# EAGLE design daclock-3.1 (EAGLE 9.4.2)
PROJECT_AUTHOR: tinkerman.cat <xose.perez@gmail.com>; PROJECT_LICENSE: CC-BY-SA-NC 3.0; PROJECT_NAME: DACLOCK WIFI; PROJECT_VERSION: 3.1.20200124
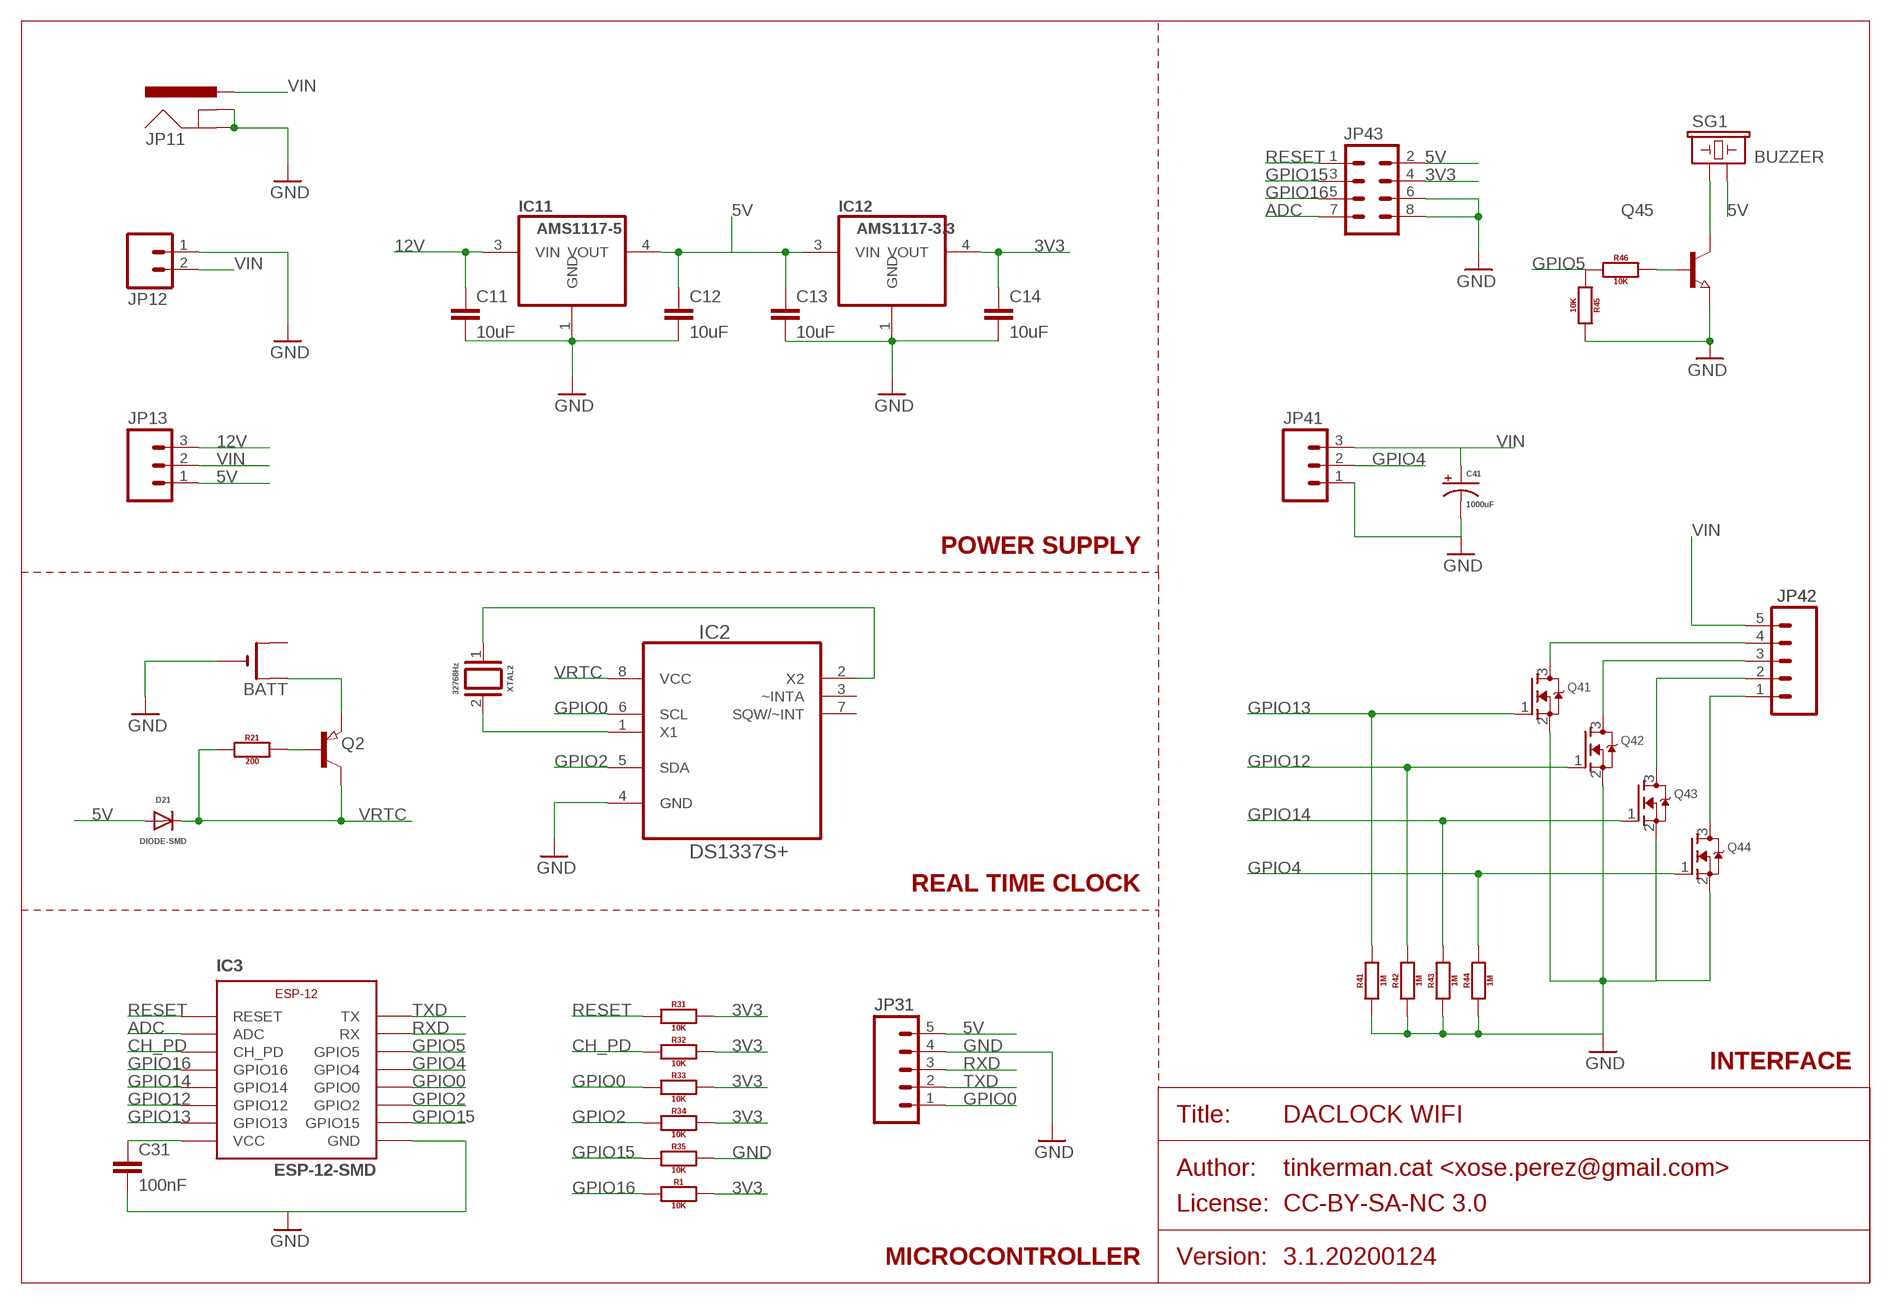
[diagram p0: schematic, sheet 1]

## Parts
BATT  CR2032SMT  [CR2032-SMD]
C11  10uF  C-EU0805  [0805]
C12  10uF  C-EU0805  [0805]
C13  10uF  C-EU0805  [0805]
C14  10uF  C-EU0805  [0805]
C31  100nF  C-EU0805  [0805]
C41  1000uF  CAP_POLG  [PANASONIC_G]
D21  DIODE-SMD  [0805_DIODE]
IC2  DS1337S+  [SOIC127P600X175-8N]
IC3  ESP-12-SMD  [ESP-12-SMD]
IC11  AMS1117-5  REG1117SOT223-2  [SOT223]
IC12  AMS1117-3.3  REG1117SOT223-2  [SOT223]
JP11  POWER_JACKPTH  [POWER_JACK_PTH]
JP12  M02200MIL  [SCREWTERMINAL-200MIL-2]
JP13  M03PTH  [1X03]
JP31  M05NO_SILK  [1X05_NO_SILK]
JP41  M03200MIL  [SCREWTERMINAL-200MIL-3]
JP42  M05NO_SILK  [1X05_NO_SILK]
JP43  M04X2  [2X4]
Q2  PNP-TRANSISTOR_SOT23  [SOT23]
Q41  MOSFET-NREFLOW  [SOT23]
Q42  MOSFET-NREFLOW  [SOT23]
Q43  MOSFET-NREFLOW  [SOT23]
Q44  MOSFET-NREFLOW  [SOT23]
Q45  NPN-TRANSISTOR_SOT23  [SOT23]
R1  10K  RESISTOR0805  [0805]
R21  200  RESISTOR0805  [0805]
R31  10K  RESISTOR0805  [0805]
R32  10K  RESISTOR0805  [0805]
R33  10K  RESISTOR0805  [0805]
R34  10K  RESISTOR0805  [0805]
R35  10K  RESISTOR0805  [0805]
R41  1M  RESISTOR0805  [0805]
R42  1M  RESISTOR0805  [0805]
R43  1M  RESISTOR0805  [0805]
R44  1M  RESISTOR0805  [0805]
R45  10K  RESISTOR0805  [0805]
R46  10K  RESISTOR0805  [0805]
SG1  BUZZER  BUZZERPTH  [BUZZER-12MM]
XTAL2  32768Hz  CRYSTAL_TC38H  [TC38H]

## Nets
3V3: C14.1 C31.1 IC3.VCC IC12.4(VOUT) JP43.4 R1.2 R31.2 R32.2 R33.2 R34.2
5V: C12.1 C13.1 D21.A IC11.4(VOUT) IC12.3(VIN) JP13.1 JP31.5 JP43.2 SG1.-
12V: C11.1 IC11.3(VIN) JP13.3
ADC: IC3.ADC JP43.7
CH_PD: IC3.CH_PD R32.1
GND: BATT.- C11.2 C12.2 C13.2 C14.2 C31.2 C41.- IC2.4(GND) IC3.GND IC11.1(GND) IC12.1(GND) JP11.GND JP11.GNDBREAK JP12.1 JP31.4 JP41.1 JP43.6 JP43.8 Q41.2(S) Q42.2(S) Q43.2(S) Q44.2(S) Q45.2(E) R35.2 R41.1 R42.1 R43.1 R44.1 R45.2
GPIO0: IC2.6(SCL) IC3.GPIO0 JP31.1 R33.1
GPIO2: IC2.5(SDA) IC3.GPIO2 R34.1
GPIO4: IC3.GPIO4 JP41.2 Q44.1(G) R44.2
GPIO5: IC3.GPIO5 R45.1 R46.1
GPIO12: IC3.GPIO12 Q42.1(G) R42.2
GPIO13: IC3.GPIO13 Q41.1(G) R41.2
GPIO14: IC3.GPIO14 Q43.1(G) R43.2
GPIO15: IC3.GPIO15 JP43.3 R35.1
GPIO16: IC3.GPIO16 JP43.5 R1.1
N$1: Q45.1(B) R46.2
N$2: IC2.1(X1) XTAL2.2
N$3: IC2.2(X2) XTAL2.1
N$4: JP42.4 Q41.3(D)
N$5: Q2.1(B) R21.2
N$6: JP42.3 Q42.3(D)
N$7: BATT.+$1(+) Q2.2(E)
N$8: JP42.2 Q43.3(D)
N$9: JP42.1 Q44.3(D)
N$10: Q45.3(C) SG1.+
RESET: IC3.RESET JP43.1 R31.1
RXD: IC3.RX JP31.3
TXD: IC3.TX JP31.2
VIN: C41.+ JP11.PWR JP12.2 JP13.2 JP41.3 JP42.5
VRTC: D21.C IC2.8(VCC) Q2.3(C) R21.1
Unconnected: BATT.+$2(+1) IC2.3(~INTA) IC2.7(SQW/~INT)

## Notes on the sheet
- POWER SUPPLY
- REAL TIME CLOCK
- INTERFACE
- MICROCONTROLLER

## Library data of the parts
BATT = xose:CR2032
C11-C14 C31 = xose:C-EU: CAPACITOR, European symbol
C41 = xose:CAP_POL: Capacitor Polarized These are standard SMD and PTH capacitors. Normally 10uF, 47uF, and 100uF in electrolytic and tantalum varieties. Always verify the external diameter of the through hole cap, it varies with capacity, voltage, and manufacturer. The EIA devices should be standard.
D21 = xose:DIODE
IC2 = xose:DS1337S+: 64 x 8, Serial, I2C Real-Time Clock; MPN: DS1337S+; OC_FARNELL: 1379748; OC_NEWARK: 08J6237; PACKAGE: SOIC-8; SUPPLIER: Maxim
IC3 = xose:ESP-12
IC11 IC12 = xose:REG1117: 800mA and 1A Low Dropout (LDO) Positive Regulator 1.8V, 2.5V, 2.85V, 3.3V, 5V, and Adj
JP11 = xose:POWER_JACK: Power Jack This is the standard 5.5mm barrel jack for power. The PTH is the most common, proven, reliable, footprint. The Slot footprint only works if the mill layer is transmitted to the PCB fab house so be warned. Mating wall wart : TOL-00298 (and others); PROD_ID: CONN-08197
JP12 = xose:M02: Standard 2-pin 0.1" header. Use with - straight break away headers ( PRT-00116) - right angle break away headers (PRT-00553) - swiss pins (PRT-00743) - machine pins (PRT-00117) - female headers (PRT-00115) Molex polarized connector foot print use with: PRT-08233 with associated crimp pins and housings. 2.54_SCREWTERM for use with PRT-10571. 3.5mm Screw Terminal footprints for PRT-08084 5mm Screw Terminal footprints for use with PRT-08432
JP13 JP41 = xose:M03: Header 3 Standard 3-pin 0.1" header. Use with straight break away headers (SKU : PRT-00116), right angle break away headers (PRT-00553), swiss pins (PRT-00743), machine pins (PRT-00117), and female headers (PRT-00115). Molex polarized connector foot print use with SKU : PRT-08232 with associated crimp pins and housings.
JP31 JP42 = xose:M05: Header 5 Standard 5-pin 0.1" header. Use with straight break away headers (SKU : PRT-00116), right angle break away headers (PRT-00553), swiss pins (PRT-00743), machine pins (PRT-00117), and female headers (PRT-00115). Molex polarized connector foot print use with SKU : PRT-08230 with associated crimp pins and housings.
JP43 = xose:M04X2: .1" header, two rows of four.
Q2 = semicon-smd-ipc:PNP-TRANSISTOR_: PNP TRANSISTOR
Q41-Q44 = adafruit:MOSFET-N: N-Channel Mosfet 2N7002E - 60V 260mA SOT23 [Digikey: 2N7002ET1GOSTR-ND] - REEL BSH103 - 30V 850mA SOT23 [Digikey: 568-5013-1-ND]
Q45 = semicon-smd-ipc:NPN-TRANSISTOR_: NPN TRANSISTOR
R1 R21 R31-R35 R41-R46 = xose:RESISTOR: Generic EU resistor symbol
SG1 = SparkFun-Electromechanical:BUZZER: Buzzer 12mm Spark Fun Electronics SKU : Comp-Buzzer
XTAL2 = xose:CRYSTAL_TC38H

## Board
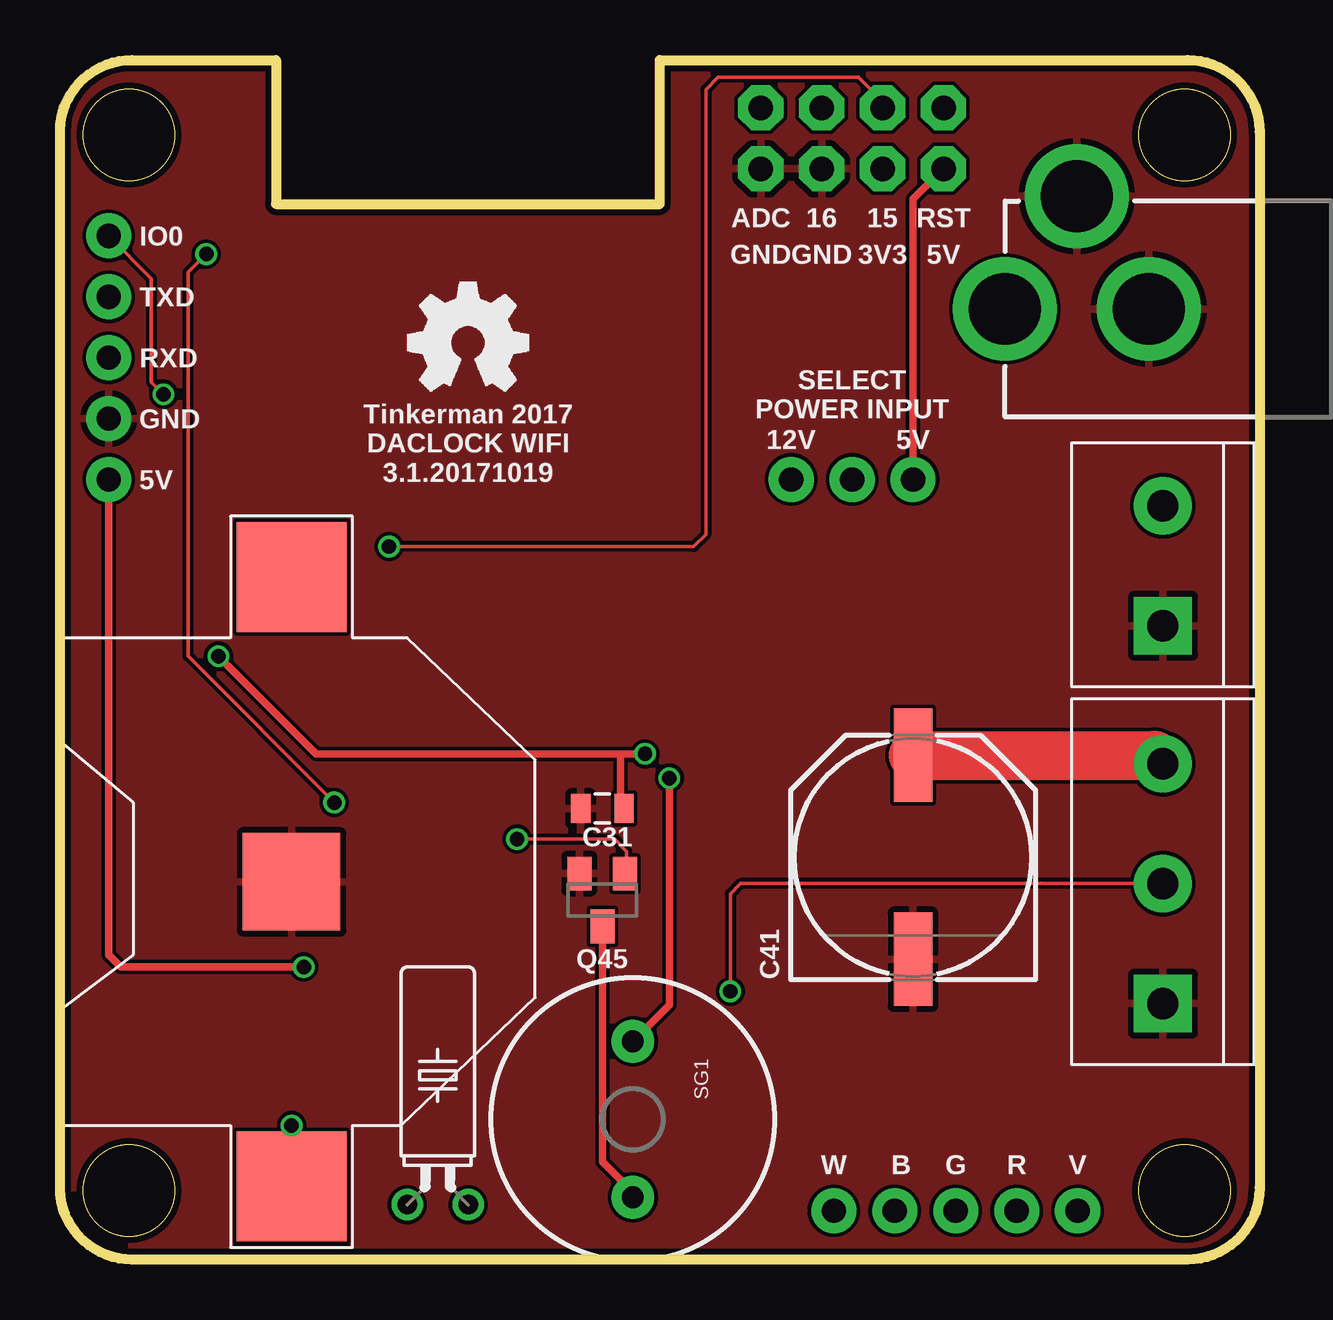
[diagram p1: board, top side]
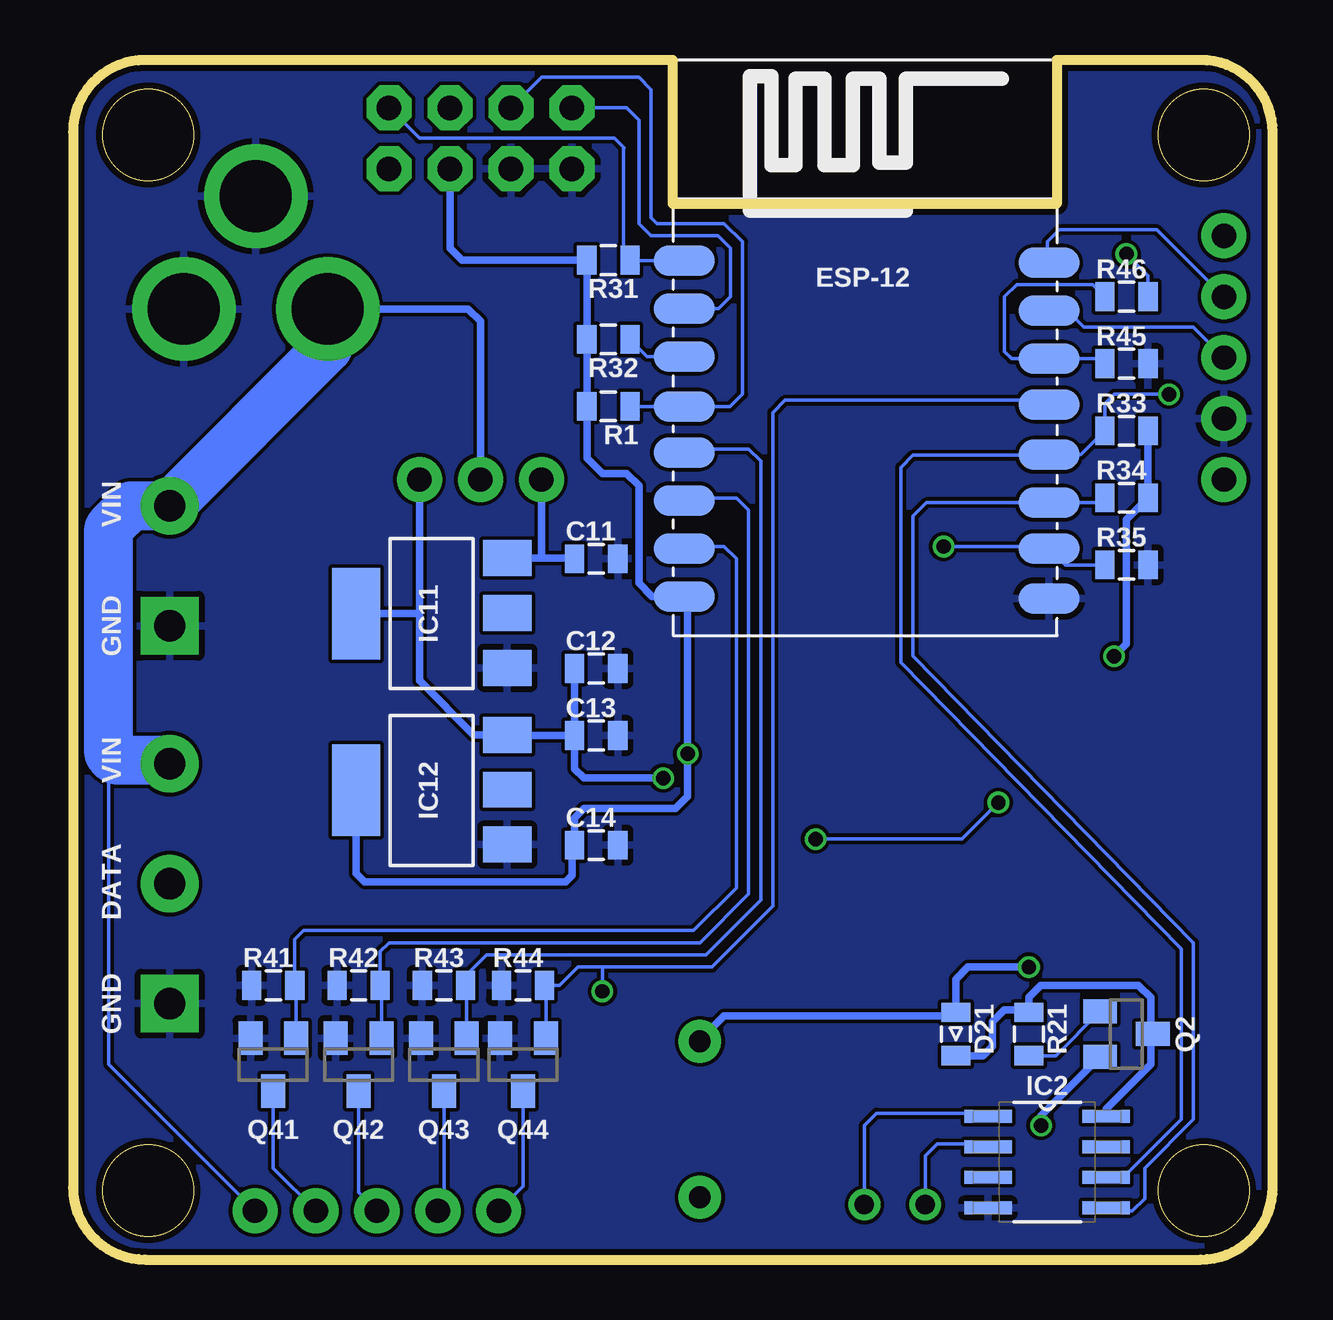
[diagram p2: board, bottom side, seen from below]

Size 50 x 50 mm. Coordinates in mm from the lower left corner, seen from the top.
Outline: 0,3 0,47 arc-90 3,50 9,50 9,44 25,44 25,50 47,50 arc-90 50,47 50,3 arc-90 47,0 3,0 arc-90 0,3
Outline: circle at 2.87,46.87 radius 1.91
Outline: circle at 46.87,46.87 radius 1.91
Outline: circle at 2.87,2.87 radius 1.91
Outline: circle at 46.87,2.87 radius 1.91
Copper layers (1*16): Top 0.035mm / dielectric 1.5mm / Bottom 0.035mm
Design rules "seedstudio-2layer": minimum track width 6mil, minimum drill 12mil, track to track 6mil, track to pad 6mil, pad to pad 6mil, via to via 6mil, smd to smd 0mil, copper to edge 10mil, drill to drill 10mil, minimum pad ring 10mil, minimum via ring 6mil, stop-mask expansion 2mil, vias tented up to drill 100mil, thermal gap 10mil

### Footprints (pad centres in the part's own frame; a part is rotated, then mirrored left to right if it is on the bottom)
CR2032-SMD = smd 4.572 x 4.572: +$1 -12.7,0; +$2 12.7,0 | smd 4.064 x 4.064: - 0,0
0805 = smd 0.8 x 1.2: 1 -0.9,0; 2 0.9,0
PANASONIC_G = smd 3.9 x 1.6: + 4.25,0; - -4.25,0
0805_DIODE = smd 0.8 x 1.2: A -0.9,0; C 0.9,0
SOIC127P600X175-8N = smd 1.981 x 0.533: 1 -2.464,1.905; 2 -2.464,0.635; 3 -2.464,-0.635; 4 -2.464,-1.905; 5 2.464,-1.905; 6 2.464,-0.635; 7 2.464,0.635; 8 2.464,1.905
ESP-12-SMD = smd 2.54 x 1.27: ADC -7,5.1; CH_PD -7,3.1; GND 8.2,-7; GPIO0 8.2,-1; GPIO2 8.2,-3; GPIO4 8.2,1.1; GPIO5 8.2,3; GPIO12 -7,-2.9; GPIO13 -7,-4.9; GPIO14 -7,-0.9; GPIO15 8.2,-4.9; GPIO16 -7,1; RESET -7,7.1; RX 8.2,5; TX 8.2,7; VCC -7,-6.9
SOT223 = smd 1.499 x 2.007: 1 -2.261,-3.15; 2 0.025,-3.15; 3 2.311,-3.15 | smd 3.81 x 2.007: 4 0,3.15
POWER_JACK_PTH = drill 2.997 pad 4.318: GND 0,7.7; GNDBREAK 4.7,10.7; PWR 0,13.7
SCREWTERMINAL-200MIL-2 = drill 1.3 pad 2.413 square: 1 0,0 | drill 1.3 pad 2.413: 2 5,0
1X03 = drill 1.016 pad 1.88: 1 0,0; 2 2.54,0; 3 5.08,0
1X05_NO_SILK = drill 1.016 pad 1.88: 1 0,0; 2 2.54,0; 3 5.08,0; 4 7.62,0; 5 10.16,0
SCREWTERMINAL-200MIL-3 = drill 1.3 pad 2.413 square: 1 0,0 | drill 1.3 pad 2.413: 2 5,0; 3 10,0
2X4 = drill 1.016 pad 1.88 octagon: 1 -3.81,-1.27; 2 -3.81,1.27; 3 -1.27,-1.27; 4 -1.27,1.27; 5 1.27,-1.27; 6 1.27,1.27; 7 3.81,-1.27; 8 3.81,1.27
SOT23 = smd 1 x 1.4: 1 -0.95,-1.1; 2 0.95,-1.1; 3 0,1.1
BUZZER-12MM = drill 0.9 pad 1.778: + 3.25,0; - -3.25,0
TC38H = drill 0.813: 1 -1.27,0; 2 1.27,0

### Placement (x,y rotation side)
BATT  9.65,15.75 90 top
C11  28.19,29.21 0 bottom
C12  28.19,24.64 0 bottom
C13  28.19,21.84 0 bottom
C14  28.19,17.27 0 bottom
C31  22.61,18.8 180 top
C41  35.56,16.76 90 top
D21  13.21,9.4 270 bottom
IC2  9.4,4.06 0 bottom
IC3  17.53,34.54 0 bottom
IC11  35.05,26.92 90 bottom
IC12  35.05,19.56 90 bottom
JP11  53.09,39.62 90 top
JP12  45.97,26.42 90 top
JP13  35.56,32.51 180 top
JP31  2.03,42.67 270 top
JP41  45.97,10.67 90 top
JP42  32.26,2.03 0 top
JP43  33.02,46.74 180 top
Q2  6.1,9.4 270 bottom
Q41  41.66,8.13 180 bottom
Q42  38.1,8.13 180 bottom
Q43  34.54,8.13 180 bottom
Q44  31.24,8.13 180 bottom
Q45  22.61,14.99 180 top
R1  27.69,35.56 180 bottom
R21  10.16,9.4 270 bottom
R31  27.69,41.66 180 bottom
R32  27.69,38.35 180 bottom
R33  6.1,34.54 0 bottom
R34  6.1,31.75 0 bottom
R35  6.1,28.96 0 bottom
R41  41.66,11.43 0 bottom
R42  38.1,11.43 0 bottom
R43  34.54,11.43 0 bottom
R44  31.24,11.43 0 bottom
R45  6.1,37.34 0 bottom
R46  6.1,40.13 0 bottom
SG1  23.88,5.84 270 top
XTAL2  15.75,2.29 0 top

### Tracks (layer width: path | path; a pad name or v marks a point on that pad's centre or on a via)
3V3  (via drill 0.6)
  Top 0.305: v24.38,21.08 23.37,21.08 | 23.37,21.08 10.67,21.08 v6.6,25.15 | 23.37,21.08 23.37,18.93 C31.1
  Bottom 0.305: IC12.4 38.2,16.1 37.85,15.75 29.46,15.75 29.21,16 29.21,17.16 | C14.1 29.09,18.4 28.7,18.8 24.89,18.8 24.38,19.3 v24.38,21.08 24.38,27.25 IC3.VCC 25.87,27.64 26.42,28.19 26.42,32.26 26.92,32.77 27.94,32.77 28.59,33.41 R1.2 R32.2 | R32.2 R31.2 33.78,41.66 34.29,42.16 JP43.4 | 28.45,38.22 R32.2 | R33.2 R34.2 6.1,30.85 6.1,25.65 v6.6,25.15
  Bottom 0.508: 29.21,17.16 C14.1
5V  (via drill 0.6)
  Top 0.305: v25.4,20.07 25.4,10.62 SG1.- | v10.16,12.19 2.54,12.19 2.03,12.7 JP31.5 | JP13.1 35.56,44.2 JP43.2
  Bottom 0.305: v25.4,20.07 28.7,20.07 29.09,20.46 C13.1 | SG1.- 23.88,9.14 22.86,10.16 13.35,10.16 D21.A 13.21,11.68 12.7,12.19 v10.16,12.19 | C13.1 C12.1 | C13.1 31.88,21.84 | 35.56,26.92 35.56,24.13 33.3,21.87 IC12.3 | 35.56,26.92 JP13.1 | 35.56,26.92 IC11.4
  Bottom 0.508: 31.88,21.84 IC12.3
12V
  Bottom 0.305: IC11.3 30.48,29.23 | 30.48,29.23 29.12,29.23 C11.1 | 30.48,29.23 JP13.3
ADC
  Bottom 0.152: IC3.ADC 23.09,39.64 22.61,40.13 22.61,42.16 23.11,42.67 25.91,42.67 26.42,43.18 26.42,47.5 26.92,48.01 JP43.7
CH_PD
  Bottom 0.152: IC3.CH_PD 26.08,37.64 R32.1
GND
  pour Top: -0.51,50.55 50.8,50.55 50.8,-0.76 -0.51,-0.76
  pour Bottom: -1.02,51.31 51.31,51.31 51.31,-1.27 -1.02,-1.27
GPIO0  (via drill 0.6)
  Top 0.152: JP31.1 3.81,40.89 3.81,36.58 v4.32,36.07
  Bottom 0.152: IC2.6 6.22,3.43 3.81,5.84 3.81,12.95 15.49,24.89 15.49,33.02 14.99,33.53 9.34,33.53 IC3.GPIO0 8,33.54 R33.1 7,35.68 6.6,36.07 v4.32,36.07
GPIO2
  Bottom 0.152: 7.2,31.54 IC3.GPIO2 14.43,31.54 14.99,30.99 14.99,25.15 3.3,13.21 3.3,5.84 5.33,3.81 5.33,2.54 5.84,2.03 6.81,2.03 IC2.5
  Bottom 0.305: 7.2,31.54 R34.1
GPIO4  (via drill 0.6)
  Top 0.152: JP41.2 28.37,15.67 27.94,15.24 v27.94,11.18
  Bottom 0.152: Q44.1 30.29,11.38 | R44.2 29.72,11.43 28.96,12.19 27.94,12.19 | 27.94,12.19 23.37,12.19 20.83,14.73 20.83,35.31 20.32,35.81 9.5,35.81 IC3.GPIO4 | v27.94,11.18 27.94,12.19
  Bottom 0.305: 30.29,11.38 R44.2
GPIO5
  Bottom 0.152: 7.2,37.54 IC3.GPIO5 10.87,37.54 11.18,37.85 11.18,40.13 10.67,40.64 7.5,40.64 R46.1
  Bottom 0.305: 7.2,37.54 R45.1
GPIO12
  Bottom 0.152: Q42.1 37.15,11.38 R42.2 37.2,12.84 36.83,13.21 23.88,13.21 21.84,15.24 21.84,31.24 22.35,31.75 24.42,31.75 IC3.GPIO12
GPIO13
  Bottom 0.152: Q41.1 40.71,11.38 R41.2 40.76,13.35 40.39,13.72 24.13,13.72 22.35,15.49 22.35,29.21 22.86,29.72 24.45,29.72 IC3.GPIO13
GPIO14
  Bottom 0.152: Q43.1 33.59,11.38 R43.2 33.64,11.82 32.77,12.7 23.62,12.7 21.34,14.99 21.34,33.27 21.84,33.78 24.39,33.78 IC3.GPIO14
GPIO15  (via drill 0.6)
  Top 0.152: JP43.3 34.29,48.26 33.27,49.28 27.43,49.28 26.92,48.77 26.92,30.23 26.42,29.72 v13.72,29.72
  Bottom 0.152: R35.1 8.64,28.96 IC3.GPIO15 9.4,29.72 v13.72,29.72
GPIO16
  Bottom 0.152: JP43.5 30.48,49.28 26.42,49.28 25.91,48.77 25.91,43.43 25.65,43.18 22.86,43.18 22.1,42.42 22.1,36.07 22.62,35.54 IC3.GPIO16 26.77,35.54 R1.1
N$1  (via drill 0.6)
  Top 0.152: v19.05,17.53 23.11,17.53 23.62,17.02 23.62,16.15 Q45.1 | v11.43,19.05 5.33,25.15 5.33,41.15 v6.1,41.91
  Bottom 0.152: R46.2 5.2,41.01 v6.1,41.91 | v19.05,17.53 12.95,17.53 v11.43,19.05
N$2
  Bottom 0.152: XTAL2.2 17.02,5.59 16.51,6.1 11.99,6.1 IC2.1
N$3
  Bottom 0.152: XTAL2.1 14.48,4.32 13.97,4.83 11.99,4.83 IC2.2
N$4
  Bottom 0.152: Q41.3 41.66,3.81 JP42.4
N$5
  Bottom 0.152: R21.2 9.05,8.5 Q2.1
N$6
  Bottom 0.152: Q42.3 38.1,2.79 JP42.3
N$7  (via drill 0.6)
  Top 0.305: BATT.+$1 v9.65,5.59
  Bottom 0.305: v9.65,5.59 9.65,5.99 Q2.2
N$8
  Bottom 0.152: Q43.3 34.54,2.29 JP42.2
N$9
  Bottom 0.152: Q44.3 31.24,3.05 JP42.1
N$10
  Top 0.305: SG1.+ 23.88,2.79 22.61,4.06 Q45.3
RESET
  Bottom 0.152: IC3.RESET 27.03,41.64 R31.1 27.05,41.92 27.05,46.35 | 27.04,46.34 27.05,46.35 | 27.05,46.35 27.43,46.74 35.56,46.74 JP43.1
RXD
  Bottom 0.152: 8.56,39.54 7.87,38.86 3.3,38.86 JP31.3
  Bottom 0.305: IC3.RX 8.56,39.54
TXD
  Bottom 0.152: IC3.TX 9.4,41.62 9.4,42.42 8.89,42.93 4.83,42.93 JP31.2
VIN
  Top 2.032: C41.+ 45.63,21.01 JP41.3
  Bottom 0.152: JP42.5 48.51,8.13 48.51,21.08
  Bottom 0.305: JP41.3 48.1,20.67 48.51,21.08 | JP13.2 33.02,39.12 33.53,39.62 JP11.PWR
  Bottom 2.032: JP11.PWR 39.39,38 JP12.2 47.58,31.42 48.51,30.48 48.51,21.08 48.26,20.83 46.13,20.83 JP41.3
VRTC
  Bottom 0.305: IC2.8 6.93,6.27 5.08,8.13 5.08,9.31 Q2.3 5.08,9.48 5.08,10.92 5.59,11.43 9.65,11.43 10.16,10.92 R21.1 10.28,10.41 11.18,10.41 11.68,9.91 11.68,8.89 12.08,8.5 D21.C

### Text on the board
tPlace: Tinkerman 2017 / DACLOCK WIFI / 3.1.20171019
tNames: IO0 | ADC | 16 | 15 | RST | GND | GND | 3V3 | 5V | TXD | RXD | GND | SELECT / POWER INPUT | 12V | 5V | 5V | W | B | G | R | V
bNames: VIN | GND | VIN | DATA | GND